# Altium schematic sheet COMPONENT BLOCKS 2.SchDoc
size A4; SheetNumber: 4; SheetTotal: 5
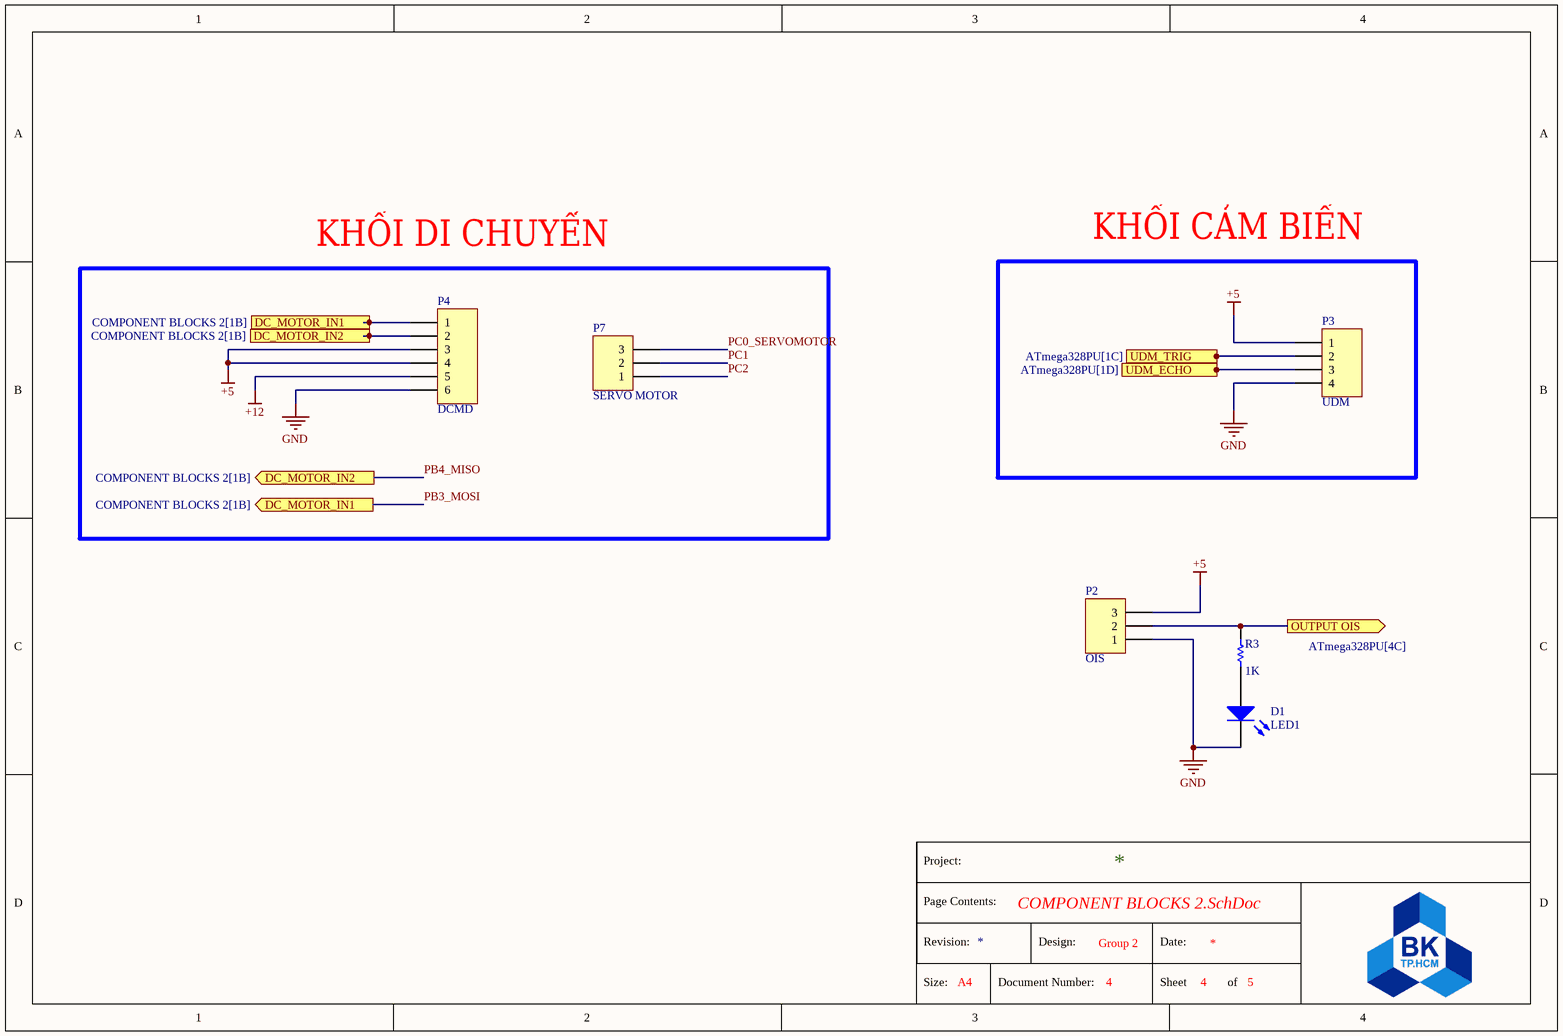
[diagram p0: COMPONENT BLOCKS 2.SchDoc]

## Parts
D1  LED1  [LED-1]
P2  OIS  [HDR1X3]
P3  UDM  [HDR1X4]
P4  DCMD  [HDR1X6]
P7  SERVO MOTOR  [HDR1X3]
R3  value 1K  [AXIAL-0.3]  (hidden comment: Res1)

## Blocks framed on the sheet
KHỐI DI CHUYỂN: P4 P7
KHỐI CẢM BIẾN: P3

## Ports
DC_MOTOR_IN1 (in, see COMPONENT BLOCKS 2[1B]), DC_MOTOR_IN1 (out, see COMPONENT BLOCKS 2[1B]), DC_MOTOR_IN2 (in, see COMPONENT BLOCKS 2[1B]), DC_MOTOR_IN2 (out, see COMPONENT BLOCKS 2[1B]), OUTPUT OIS (out, see ATmega328PU[4C]), UDM_ECHO (out, see ATmega328PU[1D]), UDM_TRIG (in, see ATmega328PU[1C])

## Nets
+5: P2.3 P3.1 P4.3 P4.4
+12: P4.5
GND: D1.2(K) P2.1 P3.4 P4.6
OUTPUT OIS: P2.2 R3.2 ; port OUTPUT OIS
PB3_MOSI: P4.1 ; port DC_MOTOR_IN1
PB4_MISO: P4.2 ; port DC_MOTOR_IN2
PC0_SERVOMOTOR: P7.3
PC1: P7.2
PC2: P7.1
UDM_ECHO: P3.3 ; port UDM_ECHO
UDM_TRIG: P3.2 ; port UDM_TRIG
NetD1_1: D1.1(A) R3.1

## Notes on the sheet
- Project:
- Page Contents:
- Revision:
- Size:
- A4
- Document Number:
- Design:
- Group 2
- Date:
- Sheet
- of

## Library data of the parts
D1 = LED1: Typical RED GaAs LED; Published: 8-Jun-2000; LatestRevisionDate: 08-Jul-2005; LatestRevisionNote: Mech Layer 1 removed.; PackageReference: LED-1; Publisher: Altium Limited; PackageDescription: LED; 2 Leads
P2 P7 = Header 3: Header, 3-Pin; LatestRevisionDate: 17-Jul-2002; LatestRevisionNote: Re-released for DXP Platform.; Publisher: Altium Limited
P3 = Header 4: Header, 4-Pin; LatestRevisionDate: 17-Jul-2002; LatestRevisionNote: Re-released for DXP Platform.; Publisher: Altium Limited
P4 = Header 6: Header, 6-Pin; LatestRevisionDate: 17-Jul-2002; LatestRevisionNote: Re-released for DXP Platform.; Publisher: Altium Limited
R3 = Res1: Resistor; Published: 8-Jun-2000; LatestRevisionDate: 17-Jul-2002; LatestRevisionNote: Re-released for DXP Platform.; PackageReference: AXIAL-0.3; Publisher: Altium Limited; PackageDescription: Axial Device, Thru-Hole; 2 Leads; 0.3 in Pin Spacing